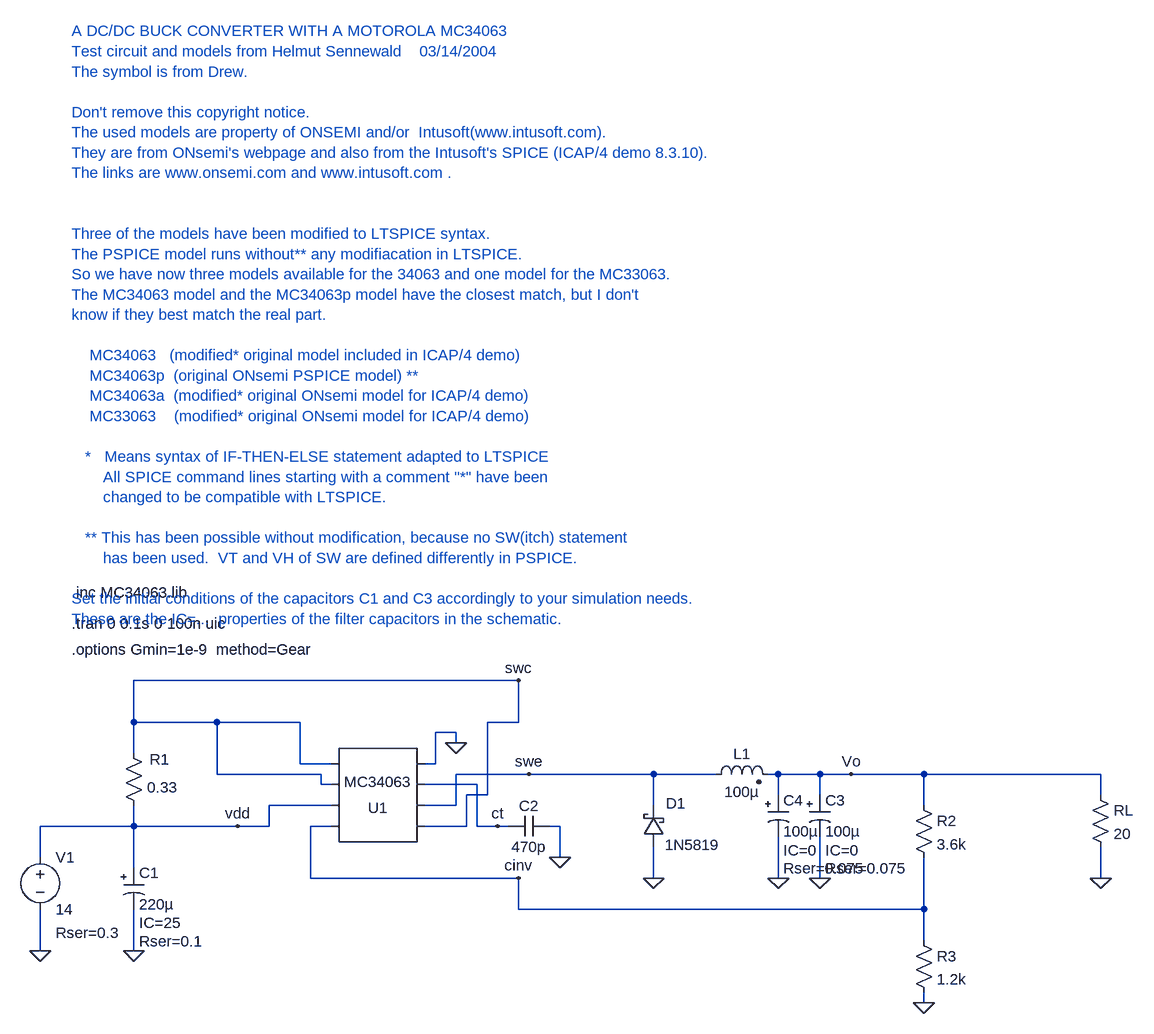
[diagram p0: schematic MC34063_buck.asc]
MC34063_buck.asc, the LTspice schematic file:
Version 4
SHEET 1 1572 772
WIRE 320 64 -272 64
WIRE -272 128 -272 64
WIRE -144 128 -272 128
WIRE -16 128 -144 128
WIRE 320 128 320 64
WIRE 320 128 272 128
WIRE 224 144 192 144
WIRE 224 160 224 144
WIRE -272 176 -272 128
WIRE -16 192 -16 128
WIRE 32 192 -16 192
WIRE 192 192 192 144
WIRE 192 192 176 192
WIRE -144 208 -144 128
WIRE 16 208 -144 208
WIRE 336 208 224 208
WIRE 528 208 336 208
WIRE 624 208 528 208
WIRE 720 208 704 208
WIRE 784 208 720 208
WIRE 832 208 784 208
WIRE 944 208 832 208
WIRE 1216 208 944 208
WIRE 16 224 16 208
WIRE 32 224 16 224
WIRE 256 224 176 224
WIRE 272 240 272 128
WIRE 272 240 240 240
WIRE 720 240 720 208
WIRE 784 240 784 208
WIRE 1216 240 1216 208
WIRE 32 256 -64 256
WIRE 224 256 224 208
WIRE 224 256 176 256
WIRE 528 256 528 208
WIRE 944 256 944 208
WIRE -272 288 -272 256
WIRE -272 288 -416 288
WIRE -112 288 -272 288
WIRE -64 288 -64 256
WIRE -64 288 -112 288
WIRE 32 288 0 288
WIRE 240 288 240 240
WIRE 240 288 176 288
WIRE 256 288 256 224
WIRE 288 288 256 288
WIRE 304 288 288 288
WIRE 384 288 368 288
WIRE -416 336 -416 288
WIRE 384 336 384 288
WIRE -272 352 -272 288
WIRE 0 368 0 288
WIRE 320 368 0 368
WIRE 528 368 528 320
WIRE 720 368 720 304
WIRE 784 368 784 304
WIRE 1216 368 1216 320
WIRE 320 416 320 368
WIRE 944 416 944 336
WIRE 944 416 320 416
WIRE 944 464 944 416
WIRE -416 480 -416 416
WIRE -272 480 -272 416
WIRE 944 560 944 544
FLAG -416 480 0
FLAG -272 480 0
FLAG 384 336 0
FLAG 528 368 0
FLAG 784 368 0
FLAG 832 208 Vo
FLAG 944 560 0
FLAG 224 160 0
FLAG 288 288 ct
FLAG 336 208 swe
FLAG -112 288 vdd
FLAG 320 368 cinv
FLAG 1216 368 0
FLAG 320 64 swc
FLAG 720 368 0
SYMBOL voltage -416 320 R0
WINDOW 123 0 0 Left 0
WINDOW 39 24 132 Left 0
SYMATTR SpiceLine Rser=0.3
SYMATTR InstName V1
SYMATTR Value 14
SYMBOL res -256 272 R180
WINDOW 0 -39 87 Left 0
WINDOW 3 -52 44 Left 0
SYMATTR InstName R1
SYMATTR Value 0.33
SYMBOL cap 304 304 R270
WINDOW 0 32 32 VTop 0
WINDOW 3 0 32 VBottom 0
SYMATTR InstName C2
SYMATTR Value 470p
SYMBOL schottky 544 320 R180
WINDOW 0 -34 67 Left 0
WINDOW 3 -86 3 Left 0
SYMATTR InstName D1
SYMATTR Value 1N5819
SYMATTR Description Diode
SYMATTR Type diode
SYMBOL ind2 608 224 R270
WINDOW 0 32 56 VTop 0
WINDOW 3 4 56 VBottom 0
SYMATTR InstName L1
SYMATTR Value 100µ
SYMATTR SpiceLine Rser=0.075
SYMATTR Type ind
SYMBOL res 928 240 R0
SYMATTR InstName R2
SYMATTR Value 3.6k
SYMBOL res 928 448 R0
SYMATTR InstName R3
SYMATTR Value 1.2k
SYMBOL res 1200 224 R0
SYMATTR InstName RL
SYMATTR Value 20
SYMBOL polcap 768 240 R0
WINDOW 39 24 113 Left 0
WINDOW 40 24 85 Left 0
SYMATTR SpiceLine Rser=0.075
SYMATTR SpiceLine2 IC=0
SYMATTR InstName C3
SYMATTR Value 100µ
SYMBOL polcap -288 352 R0
WINDOW 39 24 113 Left 0
WINDOW 40 24 85 Left 0
SYMATTR SpiceLine Rser=0.1
SYMATTR SpiceLine2 IC=25
SYMATTR InstName C1
SYMATTR Value 220µ
SYMBOL polcap 704 240 R0
WINDOW 39 24 113 Left 0
WINDOW 40 24 85 Left 0
SYMATTR SpiceLine Rser=0.075
SYMATTR SpiceLine2 IC=0
SYMATTR InstName C4
SYMATTR Value 100µ
SYMBOL AutoGenerated\\MC34063 112 240 R180
SYMATTR InstName U1
TEXT -368 -24 Left 0 !.tran 0 0.1s 0 100n uic
TEXT -368 -72 Left 0 !.inc MC34063.lib
TEXT -368 16 Left 0 !.options Gmin=1e-9  method=Gear
TEXT -368 -936 Left 0 ;A DC/DC BUCK CONVERTER WITH A MOTOROLA MC34063\nTest circuit and models from Helmut Sennewald    03/14/2004\nThe symbol is from Drew.\n \nDon't remove this copyright notice.\nThe used models are property of ONSEMI and/or  Intusoft(www.intusoft.com).\nThey are from ONsemi's webpage and also from the Intusoft's SPICE (ICAP/4 demo 8.3.10).\nThe links are www.onsemi.com and www.intusoft.com .\n \n \nThree of the models have been modified to LTSPICE syntax.\nThe PSPICE model runs without** any modifiacation in LTSPICE.\nSo we have now three models available for the 34063 and one model for the MC33063. \nThe MC34063 model and the MC34063p model have the closest match, but I don't\nknow if they best match the real part.\n \n    MC34063   (modified* original model included in ICAP/4 demo)\n    MC34063p  (original ONsemi PSPICE model) **\n    MC34063a  (modified* original ONsemi model for ICAP/4 demo)\n    MC33063    (modified* original ONsemi model for ICAP/4 demo) \n \n   *   Means syntax of IF-THEN-ELSE statement adapted to LTSPICE\n       All SPICE command lines starting with a comment "*" have been \n       changed to be compatible with LTSPICE. \n      \n   ** This has been possible without modification, because no SW(itch) statement \n       has been used.  VT and VH of SW are defined differently in PSPICE.\n \nSet the initial conditions of the capacitors C1 and C3 accordingly to your simulation needs.\nThese are the IC=...  properties of the filter capacitors in the schematic.

The netlist it stands for:
* MC34063_buck.asc
V1 vdd 0 14 Rser=0.3
R1 vdd swc 0.33
C2 ct 0 470p
D1 0 swe 1N5819
L1 swe Vo 100µ Rser=0.075
R2 Vo cinv 3.6k
R3 cinv 0 1.2k
RL Vo 0 20
C3 Vo 0 100µ Rser=0.075 IC=0
C1 vdd 0 220µ Rser=0.1 IC=25
C4 Vo 0 100µ Rser=0.075 IC=0
* U1: MC34063 (symbol AutoGenerated\MC34063 not available, pins judged from their places): pin1=swc pin2=swe pin3=ct pin4=0 pin5=cinv pin6=vdd pin7=swc pin8=swc
.model D D
.lib standard.dio
.tran 0 0.1s 0 100n uic
.inc MC34063.lib
.options Gmin=1e-9  method=Gear
* A DC/DC BUCK CONVERTER WITH A MOTOROLA MC34063
* Test circuit and models from Helmut Sennewald    03/14/2004
* The symbol is from Drew.
* Don't remove this copyright notice.
* The used models are property of ONSEMI and/or  Intusoft(www.intusoft.com).
* They are from ONsemi's webpage and also from the Intusoft's SPICE (ICAP/4 demo 8.3.10).
* The links are www.onsemi.com and www.intusoft.com .
* Three of the models have been modified to LTSPICE syntax.
* The PSPICE model runs without** any modifiacation in LTSPICE.
* So we have now three models available for the 34063 and one model for the MC33063.
* The MC34063 model and the MC34063p model have the closest match, but I don't
* know if they best match the real part.
*     MC34063   (modified* original model included in ICAP/4 demo)
*     MC34063p  (original ONsemi PSPICE model) **
*     MC34063a  (modified* original ONsemi model for ICAP/4 demo)
*     MC33063    (modified* original ONsemi model for ICAP/4 demo)
*    *   Means syntax of IF-THEN-ELSE statement adapted to LTSPICE
*        All SPICE command lines starting with a comment "*" have been
*        changed to be compatible with LTSPICE.
*    ** This has been possible without modification, because no SW(itch) statement
*        has been used.  VT and VH of SW are defined differently in PSPICE.
* Set the initial conditions of the capacitors C1 and C3 accordingly to your simulation needs.
* These are the IC=...  properties of the filter capacitors in the schematic.
.backanno
.end